# Altium project AltiumTest.PrjPcb
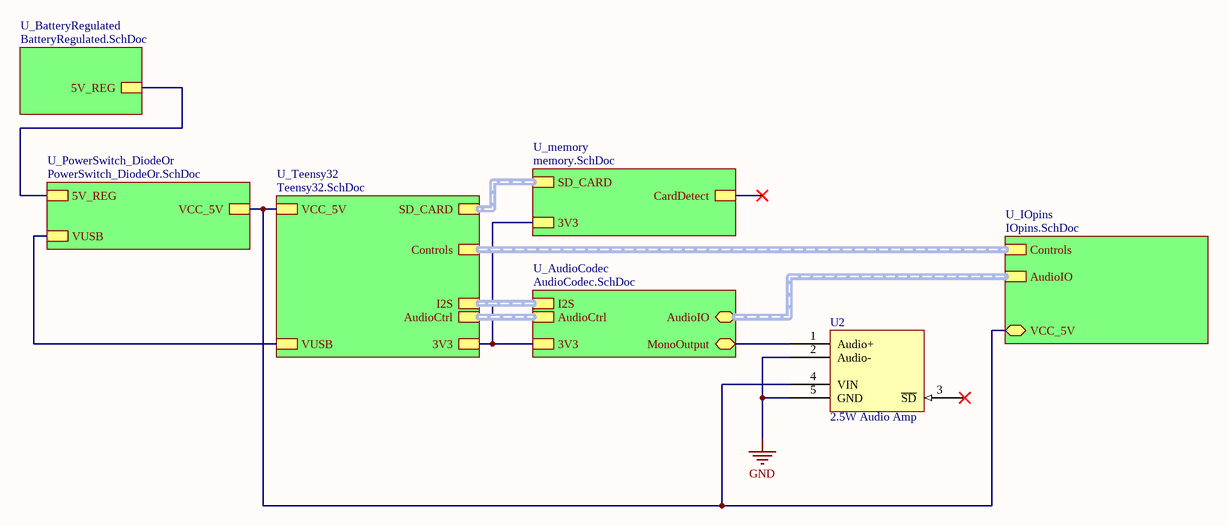
[diagram p0: TopLevel.SchDoc]
7 sheets, 56 parts. Net scope: flat (ports and power ports of the same name join across sheets).
Sheets:
  TopLevel.SchDoc
    U_Teensy32 = Teensy32.SchDoc
    U_AudioCodec = AudioCodec.SchDoc
    U_PowerSwitch_DiodeOr = PowerSwitch_DiodeOr.SchDoc
    U_memory = memory.SchDoc
    U_IOpins = IOpins.SchDoc
    U_BatteryRegulated = BatteryRegulated.SchDoc

## Sheet TopLevel.SchDoc
size A; SheetNumber: 1

### Parts
U2  2.5W Audio Amp  [Adafruit_PAM8302A]

### Sub-sheets
U_AudioCodec = AudioCodec.SchDoc: 3V3, I2S (harness I2S), AudioCtrl (harness AudioCtrl), AudioIO (harness AudioIO), MonoOutput
U_BatteryRegulated = BatteryRegulated.SchDoc: 5V_REG
U_IOpins = IOpins.SchDoc: AudioIO (harness AudioIO), Controls (harness Controls), VCC_5V
U_memory = memory.SchDoc: SD_CARD (harness SD_CARD), 3V3, CardDetect
U_PowerSwitch_DiodeOr = PowerSwitch_DiodeOr.SchDoc: 5V_REG, VCC_5V, VUSB
U_Teensy32 = Teensy32.SchDoc: 3V3, SD_CARD (harness SD_CARD), I2S (harness I2S), Controls (harness Controls), VUSB, VCC_5V, AudioCtrl (harness AudioCtrl)

### Nets
GND: U2.2(Audio-) U2.5(GND)
NetU2_1: U2.1(Audio+) ; sheet U_AudioCodec/MonoOutput
NetU2_4: U2.4(VIN) ; sheet U_Teensy32/VCC_5V, sheet U_PowerSwitch_DiodeOr/VCC_5V, sheet U_IOpins/VCC_5V
(unnamed): sheet U_Teensy32/3V3, sheet U_AudioCodec/3V3, sheet U_memory/3V3
(unnamed): sheet U_Teensy32/VUSB, sheet U_PowerSwitch_DiodeOr/VUSB
(unnamed): sheet U_PowerSwitch_DiodeOr/5V_REG, sheet U_BatteryRegulated/5V_REG

Not connected (* = marked no-connect by the designer): U2 3(~{SD})*

### Buses and harness runs
harness sheet U_AudioCodec/AudioCtrl = sheet U_Teensy32/AudioCtrl
harness sheet U_AudioCodec/AudioIO = sheet U_IOpins/AudioIO
harness sheet U_AudioCodec/I2S = sheet U_Teensy32/I2S
harness sheet U_IOpins/Controls = sheet U_Teensy32/Controls
harness sheet U_memory/SD_CARD = sheet U_Teensy32/SD_CARD

### Library data of the parts
U2 = Adafruit_PAM8302: 2.5W Class D Audio Amplifier

## Sheet Teensy32.SchDoc
size A; SheetNumber: 2
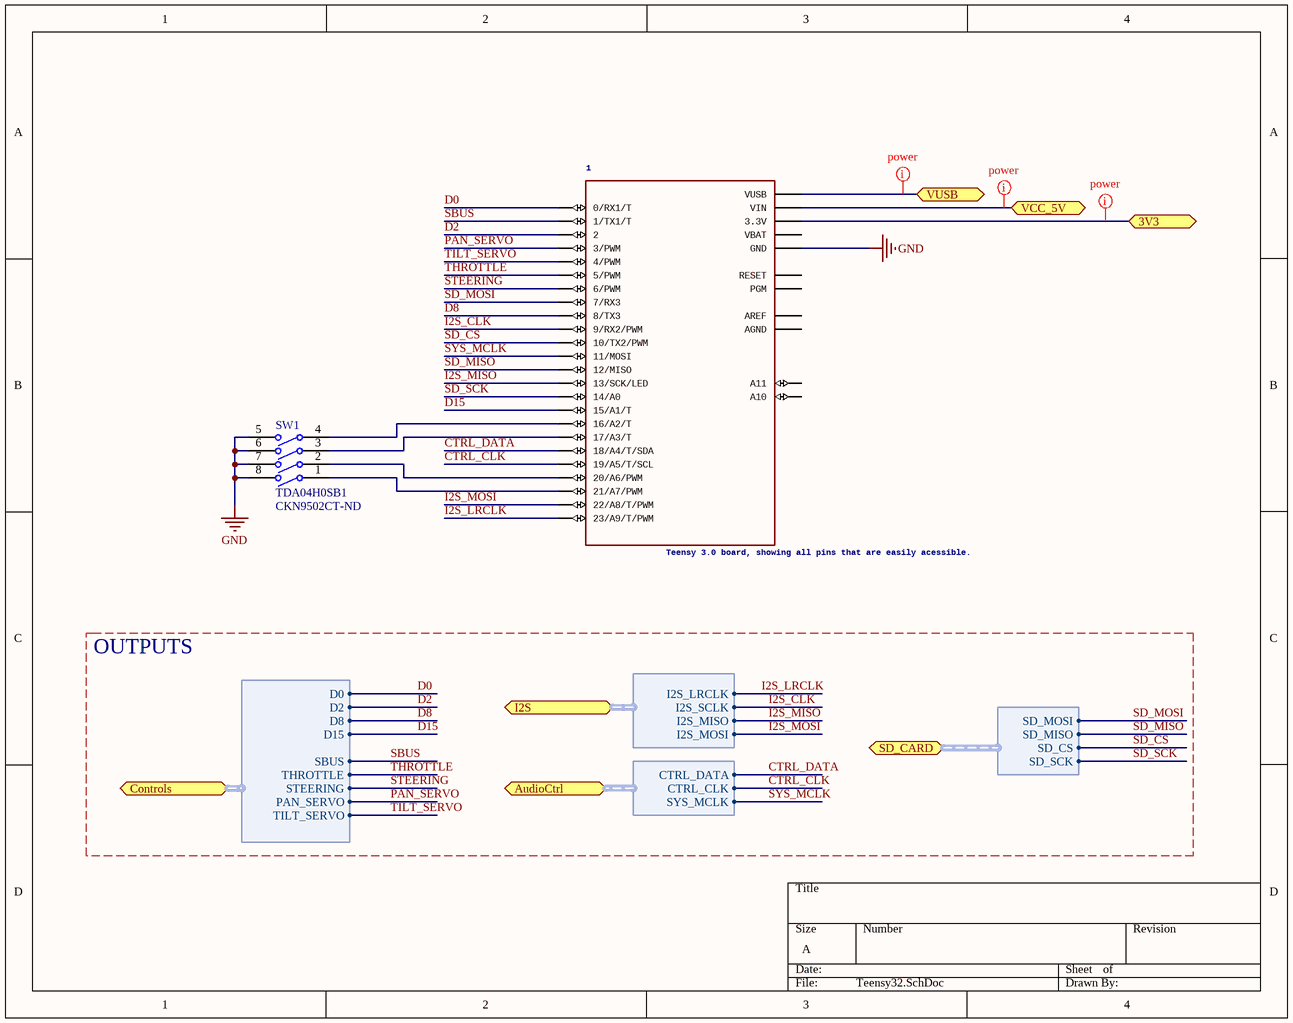
[diagram p1: Teensy32.SchDoc]

### Parts
1  Teensy 3.0 board, showing all pins that are easily acessible.  [TEENSY_3.0-3.2&LC_ALL_PINS]
SW1  TDA04H0SB1  Supplier Part Number 1: CKN9502CT-ND  [CKCP-TDA04H0SB1R_V]

### Ports
3V3, AudioCtrl (harness AudioCtrl), Controls (harness Controls), I2S (harness I2S), SD_CARD (harness SD_CARD), VCC_5V, VUSB

### Harnesses
SD_CARD: SD_MISO, SD_MOSI, SD_CS, SD_SCK
I2S: I2S_LRCLK, I2S_SCLK, I2S_MISO, I2S_MOSI
Controls: SBUS, THROTTLE, STEERING, PAN_SERVO, TILT_SERVO, D15, D8, D2, D0
AudioCtrl: CTRL_DATA, CTRL_CLK, SYS_MCLK

### Nets
GND: 1.GND_GND1(GND) SW1.5 SW1.6 SW1.7 SW1.8
CTRL_CLK: 1.19/A5(19/A5/T/SCL) ; port AudioCtrl.CTRL_CLK
CTRL_DATA: 1.18/A4(18/A4/T/SDA) ; port AudioCtrl.CTRL_DATA
D0: 1.0(0/RX1/T) ; port Controls.D0
D2: 1.2 ; port Controls.D2
D8: 1.8(8/TX3) ; port Controls.D8
D15: 1.15/A1(15/A1/T) ; port Controls.D15
I2S_CLK: 1.9(9/RX2/PWM) ; port I2S.I2S_SCLK
I2S_LRCLK: 1.23/A9(23/A9/T/PWM) ; port I2S.I2S_LRCLK
I2S_MISO: 1.13(13/SCK/LED) ; port I2S.I2S_MISO
I2S_MOSI: 1.22/A8(22/A8/T/PWM) ; port I2S.I2S_MOSI
PAN_SERVO: 1.3(3/PWM) ; port Controls.PAN_SERVO
SBUS: 1.1(1/TX1/T) ; port Controls.SBUS
SD_CS: 1.10(10/TX2/PWM) ; port SD_CARD.SD_CS
SD_MISO: 1.12(12/MISO) ; port SD_CARD.SD_MISO
SD_MOSI: 1.7(7/RX3) ; port SD_CARD.SD_MOSI
SD_SCK: 1.14/A0 ; port SD_CARD.SD_SCK
STEERING: 1.6(6/PWM) ; port Controls.STEERING
SYS_MCLK: 1.11(11/MOSI) ; port AudioCtrl.SYS_MCLK
THROTTLE: 1.5(5/PWM) ; port Controls.THROTTLE
TILT_SERVO: 1.4(4/PWM) ; port Controls.TILT_SERVO
Net1_3.3V 3.3V1: 1.3.3V_3.3V1(3.3V) ; port 3V3
Net1_16/A2: 1.16/A2(16/A2/T) SW1.4
Net1_17/A3: 1.17/A3(17/A3/T) SW1.3
Net1_20/A6: 1.20/A6(20/A6/PWM) SW1.2
Net1_21/A7: 1.21/A7(21/A7/PWM) SW1.1
Net1_VIN: 1.VIN ; port VCC_5V
Net1_VUSB: 1.VUSB ; port VUSB

Not connected (* = marked no-connect by the designer): 1 A10 A11 AGND AREF PGM RESET/DAC(RESET) VBAT

### Layout directives
net class power: Net1_3.3V 3.3V1, Net1_VIN, Net1_VUSB

### Notes on the sheet
- OUTPUTS

### Library data of the parts
1 = TEENSY_3.0_ALL_PINS: GateName_1: G$1; SymbolName_1: TEENSY_3.0_ALL_PINS; LibraryName: Teensy_3_and_LC_Series_Boards_v1.4; DeviceSetName: TEENSY_3.0_ALL_PINS
SW1 = CMP-1727-00001-1: Ultra-Miniature Surface Mount Half-Pitch DIP Switch, 25 mA, 24 V, -40 to 85 degC, 8-Pin SMD, RoHS, Tube; Contact Current Rating: 100 mA; Throw Configuration: SPST; Voltage Rating (DC): 24 V; Max Contact Resistance: 100 mohm; Max Current Rating: 25 mA; REACH SVHC: No SVHC; DatasheetVersion: 02/2016; Case\Package: DIP; Package Quantity: 70; Lead Pitch: 1.27 mm; Contact Plating: Gold; Packaging: Rail/Tube; Contact Finish: Gold; Mount: Surface Mount; Height: 2.3 mm; Contact Material: Copper; Max Operating Temperature: 85 degC; Max Voltage Rating (DC): 24 V; ComponentLink1URL: http://www.ck-components.com/media/1328/tda.pdf; PackageDescription: 8-Pin Surface Mount Device, Body 6.21 x 6.2 mm, Pitch 1.27 mm; Radiation Hardening: No; ComponentLink1Description: Datasheet; Current Rating: 100 mA; RoHSCompliant: true; PackageReference: TDA04H0SB1R; Min Operating Temperature: -40 degC; Pins: 4; Mounting Technology: Surface Mount; Length: 6.21 mm; Supplier 1: Digi-Key

## Sheet AudioCodec.SchDoc: Audio Codec
size Letter; Revision: 1.1; SheetNumber: 3
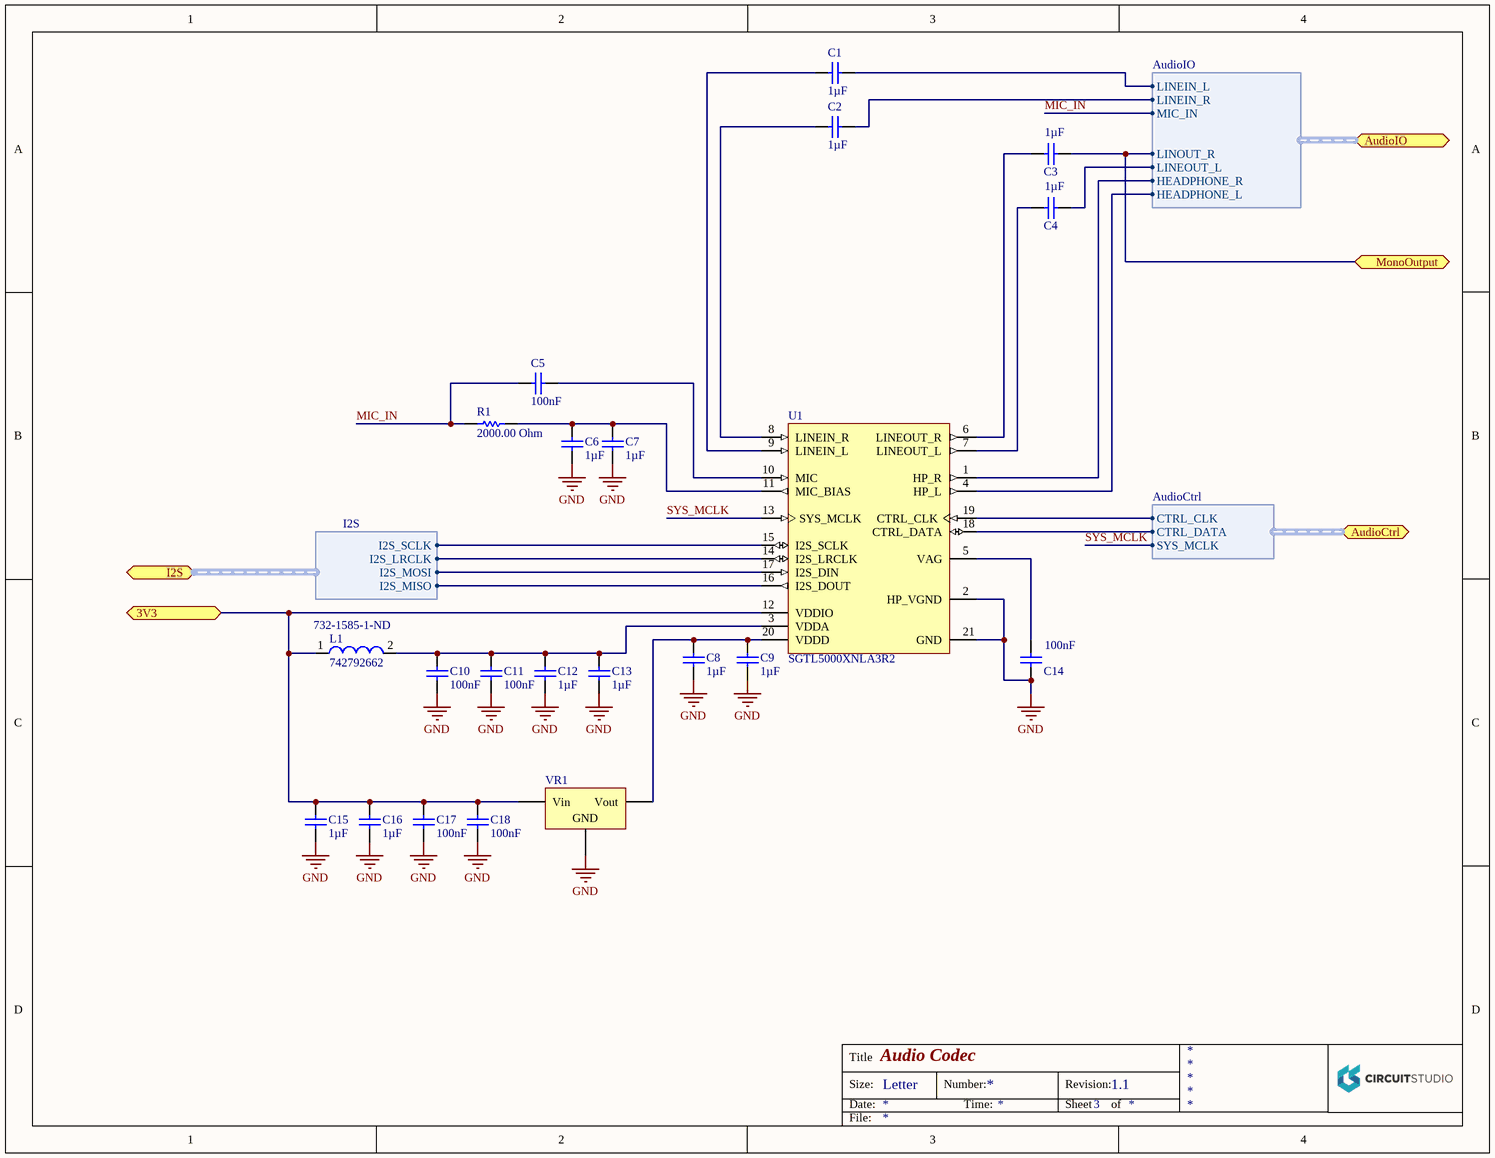
[diagram p2: AudioCodec.SchDoc]

### Parts
C1  Capacitance: 1µF  [CAPC1005X55X10ML05]  (hidden comment: C1005X5R1C105K050BC)
C2  Capacitance: 1µF  [CAPC1005X55X10ML05]  (hidden comment: C1005X5R1C105K050BC)
C3  Capacitance: 1µF  [CAPC1005X55X10ML05]  (hidden comment: C1005X5R1C105K050BC)
C4  Capacitance: 1µF  [CAPC1005X55X10ML05]  (hidden comment: C1005X5R1C105K050BC)
C5  Capacitance: 100nF  [CAPC1005X55X25NL05T10]  (hidden comment: GRM155R71C104KA88D)
C6  Capacitance: 1µF  [CAPC1005X55X10ML05]  (hidden comment: C1005X5R1C105K050BC)
C7  Capacitance: 1µF  [CAPC1005X55X10ML05]  (hidden comment: C1005X5R1C105K050BC)
C8  Capacitance: 1µF  [CAPC1005X55X10ML05]  (hidden comment: C1005X5R1C105K050BC)
C9  Capacitance: 1µF  [CAPC1005X55X10ML05]  (hidden comment: C1005X5R1C105K050BC)
C10  Capacitance: 100nF  [CAPC1005X55X25NL05T10]  (hidden comment: GRM155R71C104KA88D)
C11  Capacitance: 100nF  [CAPC1005X55X25NL05T10]  (hidden comment: GRM155R71C104KA88D)
C12  Capacitance: 1µF  [CAPC1005X55X10ML05]  (hidden comment: C1005X5R1C105K050BC)
C13  Capacitance: 1µF  [CAPC1005X55X10ML05]  (hidden comment: C1005X5R1C105K050BC)
C14  Capacitance: 100nF  [CAPC1005X55X25NL05T10]  (hidden comment: GRM155R71C104KA88D)
C15  Capacitance: 1µF  [CAPC1005X55X10ML05]  (hidden comment: C1005X5R1C105K050BC)
C16  Capacitance: 1µF  [CAPC1005X55X10ML05]  (hidden comment: C1005X5R1C105K050BC)
C17  Capacitance: 100nF  [CAPC1005X55X25NL05T10]  (hidden comment: GRM155R71C104KA88D)
C18  Capacitance: 100nF  [CAPC1005X55X25NL05T10]  (hidden comment: GRM155R71C104KA88D)
L1  742792662  Supplier Part Number 1: 732-1585-1-ND  [SMD-0603]
R1  value 2000.00 Ohm  [RESC0402(1005)_N]  (hidden comment: 2K 5% 0402(1005))
U1  SGTL5000XNLA3R2  [FRES-2032-01_L]
VR1  Volt Reg  [SOT23_L]  (value not drawn)

### Ports
3V3, AudioCtrl (harness AudioCtrl), AudioIO (harness AudioIO), I2S (harness I2S), MonoOutput

### Harnesses
I2S: I2S_LRCLK, I2S_MISO, I2S_MOSI, I2S_SCLK
AudioCtrl: CTRL_CLK, CTRL_DATA, SYS_MCLK
AudioIO: LINEIN_R, LINEIN_L, MIC_IN, LINOUT_R, LINEOUT_L, HEADPHONE_R, HEADPHONE_L

### Nets
GND: C6.2 C7.2 C8.2 C9.2 C10.2 C11.2 C12.2 C13.2 C14.1 C15.2 C16.2 C17.2 C18.2 U1.2(HP_VGND) U1.21(GND) VR1.2(GND)
CTRL_CLK: U1.19(CTRL_CLK) ; port AudioCtrl.CTRL_CLK
CTRL_DATA: U1.18(CTRL_DATA) ; port AudioCtrl.CTRL_DATA
I2S_CLK: U1.15(I2S_SCLK) ; port I2S.I2S_SCLK
I2S_LRCLK: U1.14(I2S_LRCLK) ; port I2S.I2S_LRCLK
I2S_MISO: U1.16(I2S_DOUT) ; port I2S.I2S_MISO
I2S_MOSI: U1.17(I2S_DIN) ; port I2S.I2S_MOSI
MIC_IN: C5.2 R1.1 ; port AudioIO.MIC_IN
SYS_MCLK: U1.13(SYS_MCLK) ; port AudioCtrl.SYS_MCLK
Net1_3.3V 3.3V1: C15.1 C16.1 C17.1 C18.1 L1.1 U1.12(VDDIO) VR1.1(Vin) ; port 3V3
NetC1_1: C1.1 ; port AudioIO.LINEIN_L
NetC1_2: C1.2 U1.9(LINEIN_L)
NetC2_1: C2.1 ; port AudioIO.LINEIN_R
NetC2_2: C2.2 U1.8(LINEIN_R)
NetC3_1: C3.1 ; port MonoOutput, port AudioIO.LINOUT_R
NetC3_2: C3.2 U1.6(LINEOUT_R)
NetC4_1: C4.1 ; port AudioIO.LINEOUT_L
NetC4_2: C4.2 U1.7(LINEOUT_L)
NetC5_1: C5.1 U1.10(MIC)
NetC6_1: C6.1 C7.1 R1.2 U1.11(MIC_BIAS)
NetC8_1: C8.1 C9.1 U1.20(VDDD) VR1.3(Vout)
NetC10_1: C10.1 C11.1 C12.1 C13.1 L1.2 U1.3(VDDA)
NetC14_2: C14.2 U1.5(VAG)
NetJ9_P$1: U1.1(HP_R) ; port AudioIO.HEADPHONE_R
NetJ9_P$2: U1.4(HP_L) ; port AudioIO.HEADPHONE_L

### Notes on the sheet
- Title
- Size:
- Date:
- Letter
- Number:
- Time:
- Revision:
- Sheet
- of
- File:

### Library data of the parts
C1-C4 C6-C9 C12 C13 C15 C16 = CMP-2000-05003-1: Chip Capacitor, 1 uF, +/- 10%, 16 V, -55 to 85 degC, 0402 (1005 Metric), RoHS, Tape and Reel; PCN Part Number: MLCCPartNumberChange30/Nov/2012; Manufacturer: TDK; HOUSEPART: MF-CAP-0402-1uF; Online Catalog: CSeries,GeneralPurpose; Other Names: 445-4978-6; Temperature Coefficient: X5R; Product Training Modules: CSeriesGeneralApplicationsSEAT,CCV,andTVCLDesignToolsGuidetoReplacinganElectrolyticCapacitorwithanMLCC; Voltage - Rated: 16V; Packaging: Digi-Reel; Tolerance: ±10%; Lead Spacing: -; Size / Dimension: 0.039"Lx0.020"W(1.00mmx0.50mm); Lead Style: -; Operating Temperature: -55degC~85degC; Series: C; Datasheet Version: Oct-13; Applications: GeneralPurpose; Family: CeramicCapacitors; Height - Seated (Max): -; Standard Package: 1; RoHS Information: RoHSCertificate-MLCC; Ratings: -; Package Description: 2-Pin Surface Mount Device, Body 1 x 0.5 mm; Package / Case: 0402(1005Metric); Category: Capacitors; Package Reference: 402; Datasheet URL: https://datasheet.ciiva.com/14482/1756136-14482760.pdf; Manufacturer URL: http://www.tdk.com/; Features: -; Mounting Type: SurfaceMount,MLCC; Thickness (Max): 0.022"(0.55mm)
  C6-C9 C12 C13 C15 C16: Supplier 1: Digi-Key; Supplier Part Number 1: 445-4978-1-ND
C5 C10 C11 C14 C17 C18 = CMP-2100-03641-1: Chip Capacitor, 0.1 uF, +/- 10%, 16 V, -55 to 125 degC, 0402 (1005 Metric), RoHS, Tape and Reel; Manufacturer: Murata; HOUSEPART: MF-CAP-0402-0.1uF; Material: Ceramic; Insulation Resistance: 10GR; Voltage: 16V; Dielectric: X7R; REACH SVHC: NoSVHC; Depth: 0.5mm; Case/Package: 0402; Datasheet URL: http://psearch.en.murata.com/capacitor/product/GRM155R71C104KA88%23.pdf; Lead Free: LeadFree; Dielectric Material: Ceramic; Manufacturer URL: http://www.murata.com/; Min Operating Temperature: -55degC; Length: 1mm; Case Code (Metric): 1005; Radiation Hardening: No; Package Reference: 0402; RoHSCompliant: true; Datasheet Version: 42675.0; Thickness: 0.022inch; Packaging: TapeandReel; Voltage Rating (DC): 16V; Tolerance: 10%; Max Operating Temperature: 125degC; Package Description: 2-Pin Surface Mount Device, Body 1 x 0.5 mm; Mount: SurfaceMount; Height: 0.5mm; Width: 0.5mm; Number of Pins: 2; Voltage Rating: 16V; Case Code (Imperial): 0402; Termination: SMD/SMT; Package Quantity: 1
  C5 C10 C11 C17 C18: Supplier 1: Digi-Key; Supplier Part Number 1: 490-6328-1-ND
L1 = CMP-0220-00178-1: SMD EMI Suppression Ferrite Bead WE-CBF, Z = 1000 Ohm; PackageDescription: Chip Inductor, 2-Leads, Body 1.6 x 0.8 mm; PackageVersion: 2009; PackageReference: SMD-0603; ComponentLink1URL: http://www.we-online.com; ComponentLink2URL: http://www.we-online.de/katalog/media/pdf/742792662.pdf; Impedance: 1000 Ohm; DatasheetVersion: ver 1, Mar-2010; ComponentLink1Description: Manufacturer Link; ComponentLink2Description: Datasheet; Supplier 1: Digi-Key
R1 = CMP-1011-00081-1: 2K 0.063W 5% 0402 (1005 Metric)  SMD; HOUSEPART: MF-RES-0402-2K; Case-EIA: 0402; Case-Metric: 1005; Power: 0.063 W; Technology: SMT; Tolerance: 5 %; Supplier 1: Digi-Key; Supplier Part Number 1: P2.0KJCT-ND
U1 = CMP-1078-00004-1: Low Power Stereo Codec with Headphone Amp, 1.1 to 2 V, -40 to 85 degC, 20-Pin QFN-EP, RoHS, Tape and Reel; Manufacturer: Freescale Semiconductor; SYS_MCLK Rise/Fall Time: 0.5 to 10 ns; VDDD(V): 1.1 to 2; LINEOUT Output Impedance: 320 Ohm Typ.; VDDIO(V): 1.62 to 3.6; MIC Input Impedance: 2.9 KOhm Typ.; ComponentLink1Description: Manufacturer URL; ComponentLink2Description: Datasheet; Temperature Range: -40 to 85 degC; PartNumber: SGTL5000XNLA3R2; Packing: Tape and Reel; DatasheetVersion: Rev. 6.0; ComponentLink2URL: http://cache.freescale.com/files/analog/doc/data_sheet/SGTL5000.pdf?pspll=1&Parent_nodeId=1227651963351723867067&Parent_pageType=product; RoHS: TRUE; ComponentLink3URL: http://cache.freescale.com/files/shared/doc/package_info/98ARE10742D.pdf?&Parent_nodeId=&Parent_pageType=; ComponentLink1URL: http://www.freescale.com/; PackageVersion: Rev. O; Mounting Technology: Surface Mount; PackageReference: 2032-01; ComponentLink3Description: Package Specification; PackageDescription: 20-Pin Thermally Enhanced Quad Flat Non-Lead Package(QFN), Body 3 x 3 mm, Pitch 0.4 mm
VR1 = Volt Reg: Voltage Regulator; Published: 24-Mar-1999; LatestRevisionDate: 29-May-2009; LatestRevisionNote: IPC-7351 Footprint Added.; PackageReference: D2PAK; Publisher: Altium Limited; PackageDescription: 3-Pin Transistor Outline Package 2.54 mm Pitch, 15.1 mm Lead Span; Supplier 1: Digi-Key; Supplier Part Number 1: AP7313-18SAG-7DICT-ND

## Sheet PowerSwitch_DiodeOr.SchDoc
size A
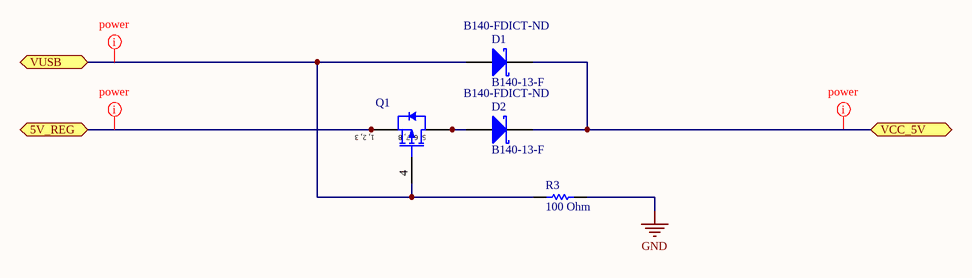
[diagram p3: PowerSwitch_DiodeOr.SchDoc]

### Parts
D1  B140-13-F  Supplier Part Number 1: B140-FDICT-ND  [DIOD-B1X0-2_V]
D2  B140-13-F  Supplier Part Number 1: B140-FDICT-ND  [DIOD-B1X0-2_V]
Q1  SiSS23DN-T1-GE3  [VISH-PPAK1212-8S_V]  (value not drawn)
R3  value 100 Ohm  [RESC0402(1005)_N]  (hidden comment: 2K 5% 0402(1005))

### Ports
5V_REG, VCC_5V, VUSB

### Nets
GND: R3.2
Net1_VIN: D1.1(K) D2.1(K) ; port VCC_5V
Net1_VUSB: D1.2(A) Q1.4(G) R3.1 ; port VUSB
NetD2_2: D2.2(A) Q1.5(D) Q1.6(D) Q1.7(D) Q1.8(D)
NetQ1_1: Q1.1(S) Q1.2(S) Q1.3(S) ; port 5V_REG

### Layout directives
net class power: Net1_VIN, Net1_VUSB, NetQ1_1

### Notes on the sheet
- (in symbol CMP-1709-00001-3) 1, 2, 3; 5, 6, 7, 8

### Library data of the parts
D1 D2 = CMP-2000-05096-1: Surface Mount Schottky Barrier Rectifier, 1 A, -65 to 150 degC, 2-Pin SMA, RoHS, Tape and Reel; Manufacturer: DiodesIncorporated; HOUSEPART: YES; MPN: MF-DIO-SMA-B140; Vrrm - Repetitive Reverse Voltage: 40V; Unit Weight: 0.002258oz; Ir - Reverse Current: 500uA; If - Forward Current: 1A; Ifsm - Forward Surge Current: 30A; Configuration: Single; Vf - Forward Voltage: 0.5V; Technology: Si; Mounting Style: SMD/SMT; Package Description: 2-Pin Surface Mount Device, Body 4.3 x 2.605 mm; Datasheet Version: Rev. 18-2, 05/2013; Product: SchottkyDiodes; Height: 2.1mm; RoHS: True; Maximum Operating Temperature: +150C; Manufacturer URL: http://www.diodes.com/; Datasheet URL: http://www.diodes.com/_files/datasheets/ds13002.pdf; Minimum Operating Temperature: -65C; Package / Case: SMA; Termination Style: SMD/SMT; Length: 4.6mm; Operating Temperature Range: -65Cto+150C; Package Reference: SMA; Product Category: SchottkyDiodes&Rectifiers; Factory Pack Quantity: 5000; Series: B140; Width: 2.92mm; Brand: DiodesIncorporated; Type: SchottkyBarrierRectifier; Packaging: Reel; Supplier 1: Digi-Key
Q1 = CMP-1709-00001-3: P-Channel MOSFET, 20 V, -50 to 150 degC, 8-Pin SMD (PPAK1212-8S), RoHS, Tape and Reel; ComponentLink3URL: http://www.vishay.com/docs/63919/caseoutl.pdf; ComponentLink1URL: http://www.vishay.com/; ComponentLink3Description: Package Specification; PackageVersion: Rev. A, 03/2012; PartNumber: SiSS23DN-T1-GE3; DatasheetVersion: Rev. A; ComponentLink1Description: Manufacturer URL; Mounting Technology: Surface Mount; ComponentLink2Description: Datasheet; PackageDescription: 8-Pin Surface Mount Device, Body 3.3 x 3.3 mm, Pitch 0.66 mm; ComponentLink2URL: http://www.vishay.com/docs/62852/siss23dn.pdf; Supplier 1: Digi-Key; Supplier Part Number 1: SISS23DN-T1-GE3CT-ND
R3 = CMP-1011-00081-1: 100 0.063W 5% 0402 (1005 Metric)  SMD; MPN: MF-RES-0402-10K; HOUSEPART: YES; Case-EIA: 0402; Case-Metric: 1005; Technology: SMT; Tolerance: 5 %; Supplier 1: Digi-Key; Supplier Part Number 1: P19853TR-ND

## Sheet memory.SchDoc
size A
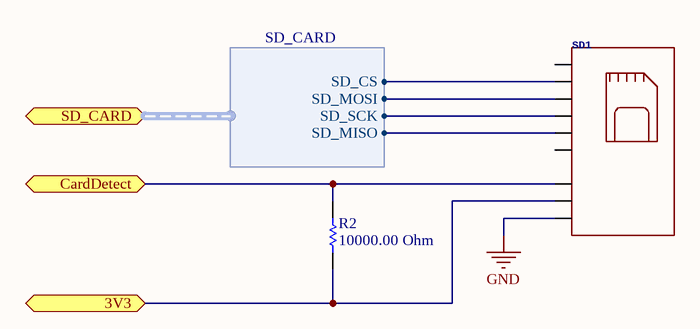
[diagram p4: memory.SchDoc]

### Parts
R2  value 10000.00 Ohm  [RESC0402(1005)_N]  (hidden comment: 2K 5% 0402(1005))
SD1  Library:  MF_Connectors Description: SD Card Connector  [MF-MICROSD]  (value not drawn)

### Ports
3V3, CardDetect, SD_CARD (harness SD_CARD)

### Harnesses
SD_CARD: SD_CS, SD_MISO, SD_MOSI, SD_SCK

### Nets
GND: SD1.G0_G1_PIN6(GND)
SD_CS: SD1.PIN2(CS) ; port SD_CARD.SD_CS
SD_MISO: SD1.PIN7(D0) ; port SD_CARD.SD_MISO
SD_MOSI: SD1.PIN3(DI) ; port SD_CARD.SD_MOSI
SD_SCK: SD1.PIN5(SCLK) ; port SD_CARD.SD_SCK
Net1_3.3V 3.3V1: R2.1 SD1.PIN4(3.3V) ; port 3V3
NetR2_2: R2.2 SD1.PIN9_PIN10(CRD_DTCT) ; port CardDetect

Not connected (* = marked no-connect by the designer): SD1 PIN1(RW) PIN8(IRQ)

### Library data of the parts
R2 = CMP-1011-00081-1: 10K 0.063W 5% 0402 (1005 Metric)  SMD; HOUSEPART: MF-RES-0402-10K; Case-EIA: 0402; Case-Metric: 1005; Power: 0.063 W; Technology: SMT; Tolerance: 5 %; Supplier 1: Digi-Key; Supplier Part Number 1: P10KJCT-ND
SD1 = SD_CARD_SLOT_MICRO_RIGHT: HOUSEPART: YES; GateName_1: G$1; POPULATE: 1; SymbolName_1: SD_CARD; DeviceName: _MICRO_RIGHT; LibraryName: MF_Connectors; DeviceSetName: SD_CARD_SLOT; MPN: MF-MICROSD; URL: https://factory.macrofab.com/part/MF-MICROSD

## Sheet IOpins.SchDoc
size A
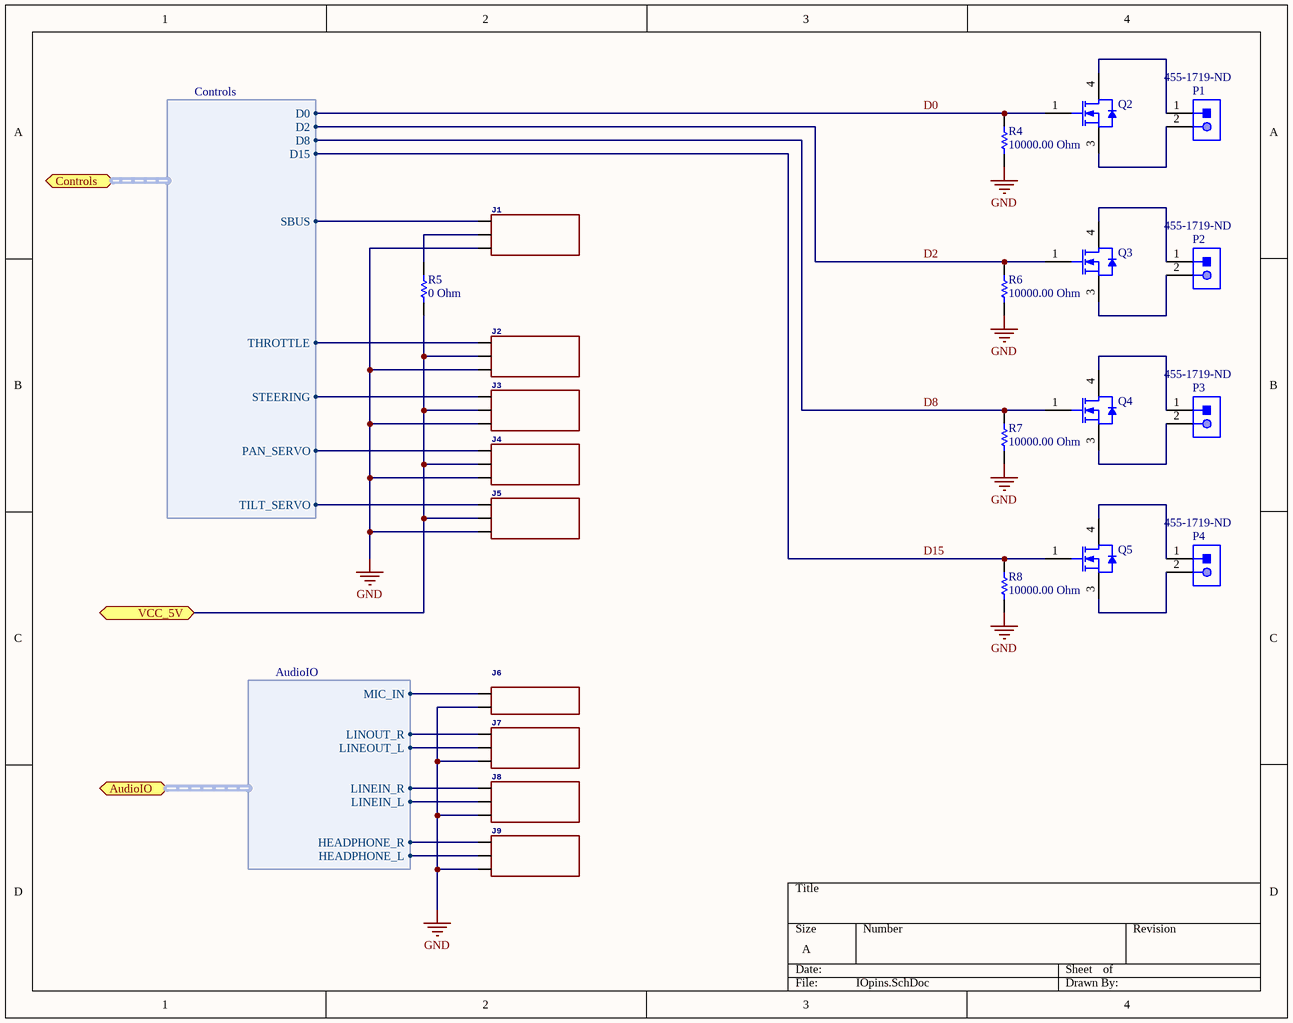
[diagram p5: IOpins.SchDoc]

### Parts
J1  Library:  MF_Connectors Description: Header Connector with 03 Positions and 01 Rows. Use the LABEL Attribute to label the pin on the schematic and PCB. You can remove the attributes on the PCB by using the SMASH function on the part and then deleting the text.  [PTH_2.54MM_01X03]  (value not drawn)
J2  Library:  MF_Connectors Description: Header Connector with 03 Positions and 01 Rows. Use the LABEL Attribute to label the pin on the schematic and PCB. You can remove the attributes on the PCB by using the SMASH function on the part and then deleting the text.  [PTH_2.54MM_01X03]  (value not drawn)
J3  Library:  MF_Connectors Description: Header Connector with 03 Positions and 01 Rows. Use the LABEL Attribute to label the pin on the schematic and PCB. You can remove the attributes on the PCB by using the SMASH function on the part and then deleting the text.  [PTH_2.54MM_01X03]  (value not drawn)
J4  Library:  MF_Connectors Description: Header Connector with 03 Positions and 01 Rows. Use the LABEL Attribute to label the pin on the schematic and PCB. You can remove the attributes on the PCB by using the SMASH function on the part and then deleting the text.  [PTH_2.54MM_01X03]  (value not drawn)
J5  Library:  MF_Connectors Description: Header Connector with 03 Positions and 01 Rows. Use the LABEL Attribute to label the pin on the schematic and PCB. You can remove the attributes on the PCB by using the SMASH function on the part and then deleting the text.  [PTH_2.54MM_01X03]  (value not drawn)
J6  Library:  MF_Connectors Description: Header Connector with 02 Positions and 01 Rows. Use the LABEL Attribute to label the pin on the schematic and PCB. You can remove the attributes on the PCB by using the SMASH function on the part and then deleting the text.  [PTH_2.54MM_01X02]  (value not drawn)
J7  Library:  MF_Connectors Description: Header Connector with 03 Positions and 01 Rows. Use the LABEL Attribute to label the pin on the schematic and PCB. You can remove the attributes on the PCB by using the SMASH function on the part and then deleting the text.  [PTH_2.54MM_01X03]  (value not drawn)
J8  Library:  MF_Connectors Description: Header Connector with 03 Positions and 01 Rows. Use the LABEL Attribute to label the pin on the schematic and PCB. You can remove the attributes on the PCB by using the SMASH function on the part and then deleting the text.  [PTH_2.54MM_01X03]  (value not drawn)
J9  Library:  MF_Connectors Description: Header Connector with 03 Positions and 01 Rows. Use the LABEL Attribute to label the pin on the schematic and PCB. You can remove the attributes on the PCB by using the SMASH function on the part and then deleting the text.  [PTH_2.54MM_01X03]  (value not drawn)
P1  Supplier Part Number 1: 455-1719-ND  [JST-S2B-PH-K-S_V]  (hidden comment: S2B-PH-K-S(LF)(SN))
P2  Supplier Part Number 1: 455-1719-ND  [JST-S2B-PH-K-S_V]  (hidden comment: S2B-PH-K-S(LF)(SN))
P3  Supplier Part Number 1: 455-1719-ND  [JST-S2B-PH-K-S_V]  (hidden comment: S2B-PH-K-S(LF)(SN))
P4  Supplier Part Number 1: 455-1719-ND  [JST-S2B-PH-K-S_V]  (hidden comment: S2B-PH-K-S(LF)(SN))
Q2  NTD5867NLT4G  [ONSC-DPAK-3-369AA-01_V]  (value not drawn)
Q3  NTD5867NLT4G  [ONSC-DPAK-3-369AA-01_V]  (value not drawn)
Q4  NTD5867NLT4G  [ONSC-DPAK-3-369AA-01_V]  (value not drawn)
Q5  NTD5867NLT4G  [ONSC-DPAK-3-369AA-01_V]  (value not drawn)
R4  value 10000.00 Ohm  [RESC0402(1005)_N]  (hidden comment: 2K 5% 0402(1005))
R5  value 0 Ohm  [RESC0402(1005)_N]  (hidden comment: 2K 5% 0402(1005))
R6  value 10000.00 Ohm  [RESC0402(1005)_N]  (hidden comment: 2K 5% 0402(1005))
R7  value 10000.00 Ohm  [RESC0402(1005)_N]  (hidden comment: 2K 5% 0402(1005))
R8  value 10000.00 Ohm  [RESC0402(1005)_N]  (hidden comment: 2K 5% 0402(1005))

### Ports
AudioIO (harness AudioIO), Controls (harness Controls), VCC_5V

### Harnesses
AudioIO: HEADPHONE_L, HEADPHONE_R, LINEIN_L, LINEIN_R, LINEOUT_L, LINOUT_R, MIC_IN
Controls: D0, D15, D2, D8, PAN_SERVO, SBUS, STEERING, THROTTLE, TILT_SERVO

### Nets
GND: J1.P$3(PIN3) J2.P$3(PIN3) J3.P$3(PIN3) J4.P$3(PIN3) J5.P$3(PIN3) J6.P$2(PIN2) J7.P$3(PIN3) J8.P$3(PIN3) J9.P$3(PIN3) R4.1 R6.1 R7.1 R8.1
D0: Q2.1(G) R4.2 ; port Controls.D0
D2: Q3.1(G) R6.2 ; port Controls.D2
D8: Q4.1(G) R7.2 ; port Controls.D8
D15: Q5.1(G) R8.2 ; port Controls.D15
MIC_IN: J6.P$1(PIN1) ; port AudioIO.MIC_IN
PAN_SERVO: J4.P$1(PIN1) ; port Controls.PAN_SERVO
SBUS: J1.P$1(PIN1) ; port Controls.SBUS
STEERING: J3.P$1(PIN1) ; port Controls.STEERING
THROTTLE: J2.P$1(PIN1) ; port Controls.THROTTLE
TILT_SERVO: J5.P$1(PIN1) ; port Controls.TILT_SERVO
Net1_VIN: J2.P$2(PIN2) J3.P$2(PIN2) J4.P$2(PIN2) J5.P$2(PIN2) R5.1 ; port VCC_5V
NetC1_1: J8.P$2(PIN2) ; port AudioIO.LINEIN_L
NetC2_1: J8.P$1(PIN1) ; port AudioIO.LINEIN_R
NetC3_1: J7.P$1(PIN1) ; port AudioIO.LINOUT_R
NetC4_1: J7.P$2(PIN2) ; port AudioIO.LINEOUT_L
NetJ1_P$2: J1.P$2(PIN2) R5.2
NetJ9_P$1: J9.P$1(PIN1) ; port AudioIO.HEADPHONE_R
NetJ9_P$2: J9.P$2(PIN2) ; port AudioIO.HEADPHONE_L
NetP1_1: P1.1 Q2.4(D)
NetP1_2: P1.2 Q2.3(S)
NetP2_1: P2.1 Q3.4(D)
NetP2_2: P2.2 Q3.3(S)
NetP3_1: P3.1 Q4.4(D)
NetP3_2: P3.2 Q4.3(S)
NetP4_1: P4.1 Q5.4(D)
NetP4_2: P4.2 Q5.3(S)

### Library data of the parts
J1-J5 J7-J9 = CON_01X03_PTH_2.54MM: HOUSEPART: YES; MPN: MF-CON-2.54mm-01x03; GateName_1: G$1; POPULATE: 1; SymbolName_1: CON_01X03; DeviceName: _PTH_2.54MM; LibraryName: MF_Connectors; DeviceSetName: CON_01X03; URL: https://factory.macrofab.com/part/MF-CON-2.54mm-01x03
J6 = CON_01X02_PTH_2.54MM: HOUSEPART: YES; MPN: MF-CON-2.54mm-01x02; GateName_1: G$1; POPULATE: 1; SymbolName_1: CON_01X02; DeviceName: _PTH_2.54MM; LibraryName: MF_Connectors; DeviceSetName: CON_01X02; URL: https://factory.macrofab.com/part/MF-CON-2.54mm-01x02
P1-P4 = CMP-1755-00004-1: Male Header, Pitch 2 mm, 1 x 2 Position, Height 4.8 mm, Tail Length 3.4 mm, -25 to 85 degC, RoHS, Bulk; Case\Package: Radial; Tolerance: 20%; Capacitance: 10 uF; Voltage Rating (DC): 50 V; Packaging: Bulk; ComponentLink1URL: http://www.jst-mfg.com/product/pdf/eng/ePH.pdf; Radiation Hardening: No; Height: 11 mm; Package Quantity: 200; PackageDescription: Male Header, Pitch 2 mm, 1 x 2 Position, Height 4.8 mm, Tail Length 3.4 mm; PackageReference: S2B-PH-K-S; Diameter: 5 mm; Pins: 2; Mount: Through Hole; Max Operating Temperature: 85 degC; Min Operating Temperature: -40 degC; ComponentLink1Description: Datasheet; DatasheetVersion: Dec-12; Length: 11 mm; Lead Pitch: 2 mm; REACH SVHC: No SVHC; Voltage Rating: 50 V; RoHSCompliant: true; Supplier 1: Digi-Key
Q2-Q5 = CMP-1058-00318-1: N-Channel Power MOSFET, 60 V, 20 A, 39 mOhm, 3-Pin DPAK, Pb-Free, Tape and Reel; Manufacturer: On Semiconductor; V(BR)DSS Min (V): 60; Channel Polarity: N Channel; VGS(th) Max (V): 2.5; Coss Typ (pF): 68; Ciss Typ (pF): 675; Configuration: Single; Qrr Typ (nC): 12; PD Max (W): 36; Crss Typ (pF): 47; ComponentLink3URL: http://www.onsemi.cn/pub_link/Collateral/369AA.PDF; Packing: Tape and Reel; ComponentLink1URL: http://www.onsemi.com/; RoHS: Pb-Free; PartNumber: NTD5867NLT4G; DatasheetVersion: Rev. 2; PackageReference: DPAK-3-369AA-01; Package Type: DPAK-3, IPAK-4; PackageVersion: Rev. B, 06/2010; Mounting Technology: Surface Mount; ComponentLink2URL: http://www.onsemi.com/pub/Collateral/NTD5867NL-D.PDF; ComponentLink1Description: Manufacturer URL; ComponentLink2Description: Datasheet; ComponentLink3Description: Package Specification; PackageDescription: 3-Pin Flange Mount, Body 6.54 x 6.095 mm, Pitch 2.29 mm; Supplier 1: Digi-Key; Supplier Part Number 1: NTD5867NLT4GOSCT-ND
R4-R8 = CMP-1011-00081-1: as R2 on sheet memory; Power: 0.063 W; Technology: SMT; Tolerance: 5 %; Supplier 1: Digi-Key
  R4 R6-R8: Supplier Part Number 1: P10KJCT-ND
  R5: Supplier Part Number 1: 1276-3480-1-ND

## Sheet BatteryRegulated.SchDoc
size A
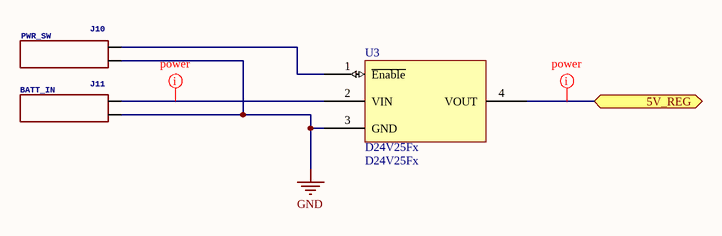
[diagram p6: BatteryRegulated.SchDoc]

### Parts
J10  PWR_SW  [PTH_2.54MM_01X02]
J11  BATT_IN  [PTH_2.54MM_01X02]
U3  D24V25Fx  [D24V50Fx]

### Ports
5V_REG

### Nets
GND: J10.P$1(PIN1) J11.P$1(PIN1) U3.3(GND)
NetJ10_P$2: J10.P$2(PIN2) U3.1(~{Enable})
NetJ11_P$2: J11.P$2(PIN2) U3.2(VIN)
NetQ1_1: U3.4(VOUT) ; port 5V_REG

### Layout directives
net class power: NetJ11_P$2, NetQ1_1

### Library data of the parts
J10 J11 = CON_01X02_PTH_2.54MM: as J6 on sheet IOpins; SymbolName_1: CON_01X02; DeviceName: _PTH_2.54MM; LibraryName: MF_Connectors; DeviceSetName: CON_01X02; URL: https://factory.macrofab.com/part/MF-CON-2.54mm-01x02
U3 = D24V25Fx: DC Step Down Regulators from Pololu; Name: D24V25Fx

## Nets that join several sheets
GND: TopLevel (U2.2 U2.5), Teensy32 (5 pins), AudioCodec (16 pins), PowerSwitch_DiodeOr (R3.2), memory (SD1.G0 G1 PIN6), IOpins (13 pins), BatteryRegulated (J10.P$1 J11.P$1 U3.3)
CTRL_CLK: Teensy32 (1.19/A5), AudioCodec (U1.19)
CTRL_DATA: Teensy32 (1.18/A4), AudioCodec (U1.18)
D0: Teensy32 (1.0), IOpins (Q2.1 R4.2)
D2: Teensy32 (1.2), IOpins (Q3.1 R6.2)
D8: Teensy32 (1.8), IOpins (Q4.1 R7.2)
D15: Teensy32 (1.15/A1), IOpins (Q5.1 R8.2)
I2S_CLK: Teensy32 (1.9), AudioCodec (U1.15)
I2S_LRCLK: Teensy32 (1.23/A9), AudioCodec (U1.14)
I2S_MISO: Teensy32 (1.13), AudioCodec (U1.16)
I2S_MOSI: Teensy32 (1.22/A8), AudioCodec (U1.17)
MIC_IN: AudioCodec (C5.2 R1.1), IOpins (J6.P$1)
Net1_3.3V 3.3V1: Teensy32 (1.3.3V 3.3V1), AudioCodec (7 pins), memory (R2.1 SD1.PIN4)
Net1_VIN: Teensy32 (1.VIN), PowerSwitch_DiodeOr (D1.1 D2.1), IOpins (5 pins)
Net1_VUSB: Teensy32 (1.VUSB), PowerSwitch_DiodeOr (D1.2 Q1.4 R3.1)
NetC1_1: AudioCodec (C1.1), IOpins (J8.P$2)
NetC2_1: AudioCodec (C2.1), IOpins (J8.P$1)
NetC3_1: AudioCodec (C3.1), IOpins (J7.P$1)
NetC4_1: AudioCodec (C4.1), IOpins (J7.P$2)
NetJ9_P$1: AudioCodec (U1.1), IOpins (J9.P$1)
NetJ9_P$2: AudioCodec (U1.4), IOpins (J9.P$2)
NetQ1_1: PowerSwitch_DiodeOr (Q1.1 Q1.2 Q1.3), BatteryRegulated (U3.4)
PAN_SERVO: Teensy32 (1.3), IOpins (J4.P$1)
SBUS: Teensy32 (1.1), IOpins (J1.P$1)
SD_CS: Teensy32 (1.10), memory (SD1.PIN2)
SD_MISO: Teensy32 (1.12), memory (SD1.PIN7)
SD_MOSI: Teensy32 (1.7), memory (SD1.PIN3)
SD_SCK: Teensy32 (1.14/A0), memory (SD1.PIN5)
STEERING: Teensy32 (1.6), IOpins (J3.P$1)
SYS_MCLK: Teensy32 (1.11), AudioCodec (U1.13)
THROTTLE: Teensy32 (1.5), IOpins (J2.P$1)
TILT_SERVO: Teensy32 (1.4), IOpins (J5.P$1)